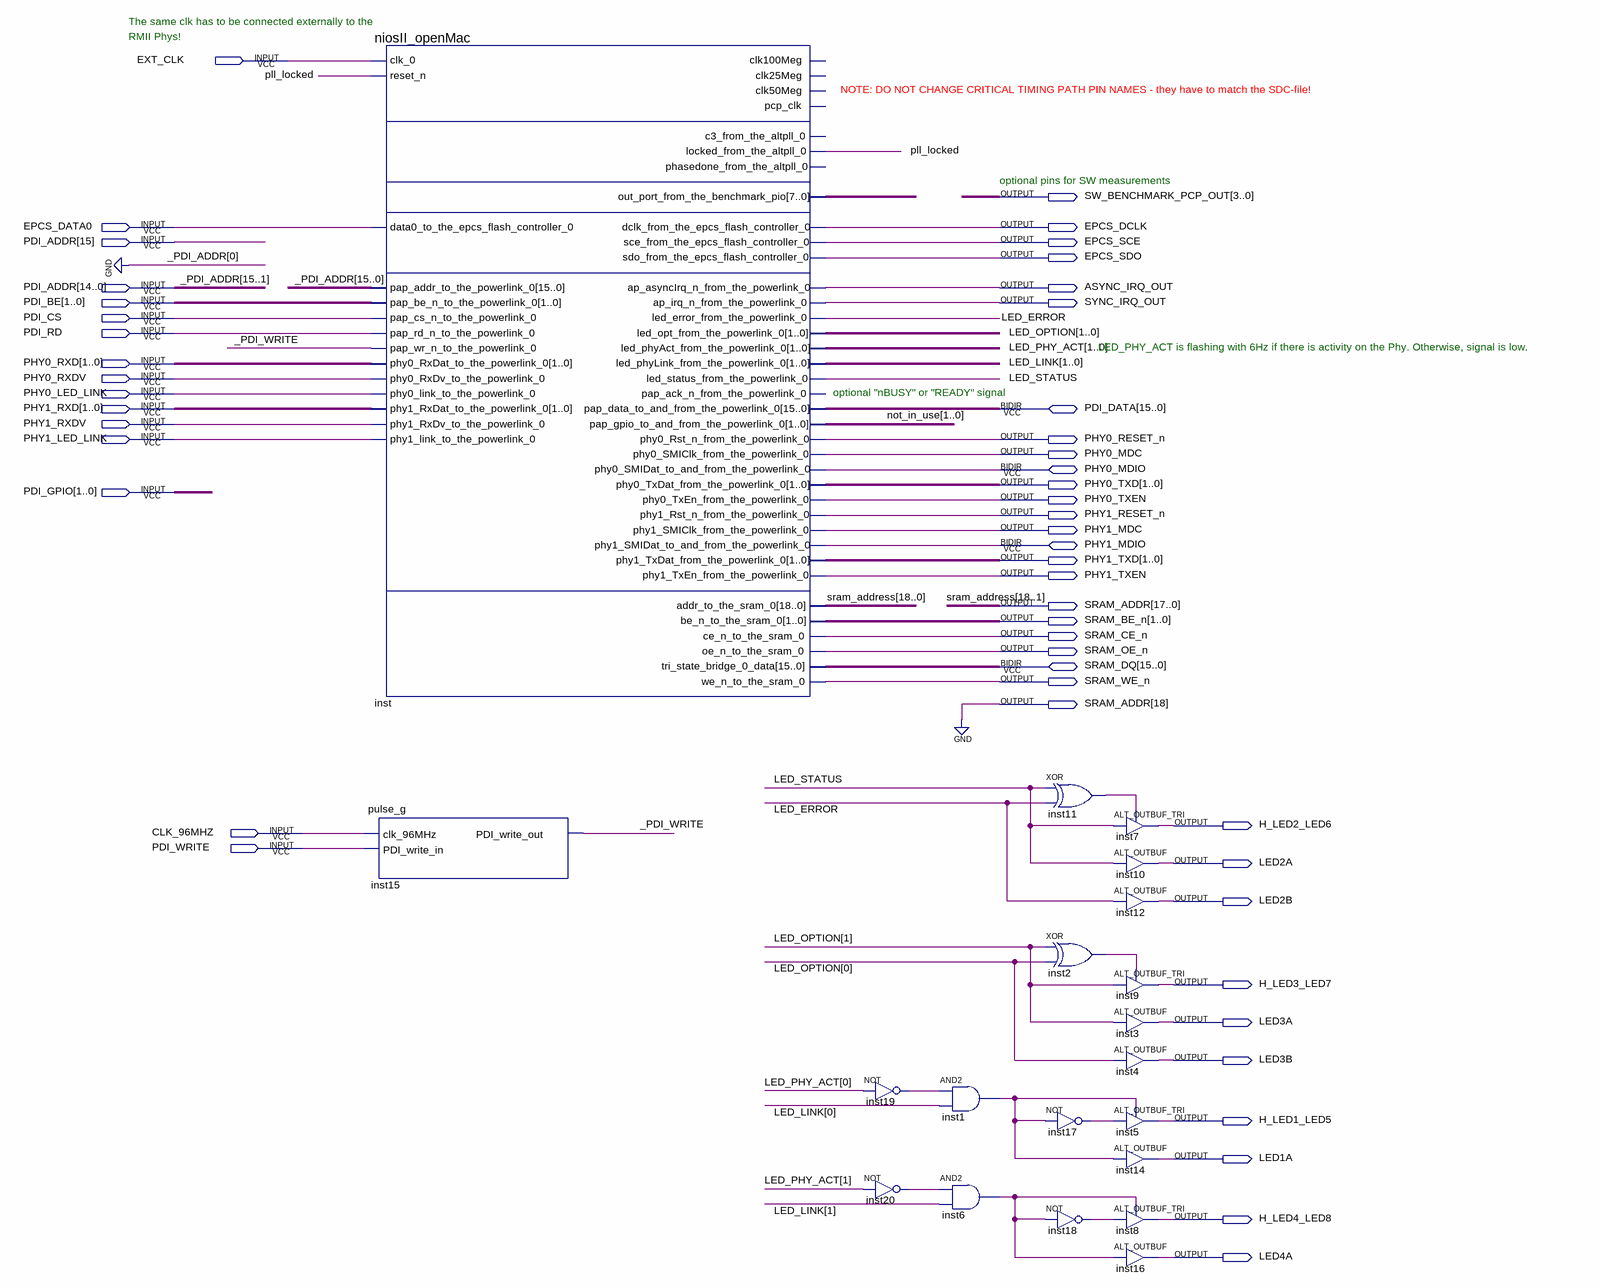
[diagram p0: schematic sheet]
// Quartus schematic nios_pll.bdf as structural Verilog: 20 symbols, 50 pins
module nios_pll (
  input  EXT_CLK,
  input  EPCS_DATA0,
  input  [15:0] PDI_ADDR,
  input  [1:0] PDI_BE,
  input  PDI_CS,
  input  PDI_RD,
  input  [1:0] PHY0_RXD,
  input  PHY0_RXDV,
  input  PHY0_LED_LINK,
  input  [1:0] PHY1_RXD,
  input  PHY1_RXDV,
  input  PHY1_LED_LINK,
  input  [1:0] PDI_GPIO,
  input  CLK_96MHZ,
  input  PDI_WRITE,
  inout  [15:0] PDI_DATA,
  inout  PHY0_MDIO,
  inout  PHY1_MDIO,
  inout  [15:0] SRAM_DQ,
  output [3:0] SW_BENCHMARK_PCP_OUT,
  output EPCS_DCLK,
  output EPCS_SCE,
  output EPCS_SDO,
  output ASYNC_IRQ_OUT,
  output SYNC_IRQ_OUT,
  output PHY0_RESET_n,
  output PHY0_MDC,
  output [1:0] PHY0_TXD,
  output PHY0_TXEN,
  output PHY1_RESET_n,
  output PHY1_MDC,
  output [1:0] PHY1_TXD,
  output PHY1_TXEN,
  output [18:0] SRAM_ADDR,
  output [1:0] SRAM_BE_n,
  output SRAM_CE_n,
  output SRAM_OE_n,
  output SRAM_WE_n,
  output H_LED2_LED6,
  output LED2A,
  output LED2B,
  output H_LED3_LED7,
  output LED3A,
  output LED3B,
  output H_LED1_LED5,
  output LED1A,
  output H_LED4_LED8,
  output LED4A
);

  wire _PDI_WRITE, inst1_out, inst2_out, inst6_out, inst11_out, inst17_out, inst18_out, inst19_out,
       inst20_out, LED_ERROR, LED_STATUS, pll_locked;
  wire [0:0] sram_address;
  wire [1:0] LED_LINK, LED_OPTION, LED_PHY_ACT, not_in_use;
  wire [7:0] inst_out_port_from_the_benchmark_pio;

  niosII_openMac inst (
    .clk_0(EXT_CLK), .reset_n(pll_locked), .data0_to_the_epcs_flash_controller_0(EPCS_DATA0),
    .pap_addr_to_the_powerlink_0({PDI_ADDR[14:0], 1'b0}), .pap_be_n_to_the_powerlink_0(PDI_BE),
    .pap_cs_n_to_the_powerlink_0(PDI_CS), .pap_rd_n_to_the_powerlink_0(PDI_RD),
    .pap_wr_n_to_the_powerlink_0(_PDI_WRITE), .phy0_RxDat_to_the_powerlink_0(PHY0_RXD),
    .phy0_RxDv_to_the_powerlink_0(PHY0_RXDV), .phy0_link_to_the_powerlink_0(PHY0_LED_LINK),
    .phy1_RxDat_to_the_powerlink_0(PHY1_RXD), .phy1_RxDv_to_the_powerlink_0(PHY1_RXDV),
    .phy1_link_to_the_powerlink_0(PHY1_LED_LINK), .locked_from_the_altpll_0(pll_locked),
    .out_port_from_the_benchmark_pio(inst_out_port_from_the_benchmark_pio),
    .dclk_from_the_epcs_flash_controller_0(EPCS_DCLK), .sce_from_the_epcs_flash_controller_0(EPCS_SCE),
    .sdo_from_the_epcs_flash_controller_0(EPCS_SDO), .ap_asyncIrq_n_from_the_powerlink_0(ASYNC_IRQ_OUT),
    .ap_irq_n_from_the_powerlink_0(SYNC_IRQ_OUT), .led_error_from_the_powerlink_0(LED_ERROR),
    .led_opt_from_the_powerlink_0(LED_OPTION), .led_phyAct_from_the_powerlink_0(LED_PHY_ACT),
    .led_phyLink_from_the_powerlink_0(LED_LINK), .led_status_from_the_powerlink_0(LED_STATUS),
    .phy0_Rst_n_from_the_powerlink_0(PHY0_RESET_n), .phy0_SMIClk_from_the_powerlink_0(PHY0_MDC),
    .phy0_TxDat_from_the_powerlink_0(PHY0_TXD), .phy0_TxEn_from_the_powerlink_0(PHY0_TXEN),
    .phy1_Rst_n_from_the_powerlink_0(PHY1_RESET_n), .phy1_SMIClk_from_the_powerlink_0(PHY1_MDC),
    .phy1_TxDat_from_the_powerlink_0(PHY1_TXD), .phy1_TxEn_from_the_powerlink_0(PHY1_TXEN),
    .addr_to_the_sram_0({SRAM_ADDR[17:0], sram_address[0]}), .be_n_to_the_sram_0(SRAM_BE_n),
    .ce_n_to_the_sram_0(SRAM_CE_n), .oe_n_to_the_sram_0(SRAM_OE_n), .we_n_to_the_sram_0(SRAM_WE_n),
    .pap_data_to_and_from_the_powerlink_0(PDI_DATA), .pap_gpio_to_and_from_the_powerlink_0(not_in_use),
    .phy0_SMIDat_to_and_from_the_powerlink_0(PHY0_MDIO), .phy1_SMIDat_to_and_from_the_powerlink_0(PHY1_MDIO),
    .tri_state_bridge_0_data(SRAM_DQ));  // open: clk100Meg, clk25Meg, clk50Meg, pcp_clk, c3_from_the_altpll_0, phasedone_from_the_altpll_0, pap_ack_n_from_the_powerlink_0
  pulse_g inst15 (.clk_96MHz(CLK_96MHZ), .PDI_write_in(PDI_WRITE), .PDI_write_out(_PDI_WRITE));
  not inst19 (inst19_out, LED_PHY_ACT[0]);
  not inst20 (inst20_out, LED_PHY_ACT[1]);
  and inst1 (inst1_out, inst19_out, LED_LINK[0]);
  and inst6 (inst6_out, inst20_out, LED_LINK[1]);
  xor inst11 (inst11_out, LED_STATUS, LED_ERROR);
  xor inst2 (inst2_out, LED_OPTION[1], LED_OPTION[0]);
  not inst17 (inst17_out, inst1_out);
  not inst18 (inst18_out, inst6_out);
  ALT_OUTBUF_TRI inst7 (.i(LED_STATUS), .oe(inst11_out), .o(H_LED2_LED6));
  ALT_OUTBUF inst10 (.i(LED_STATUS), .o(LED2A));
  ALT_OUTBUF inst12 (.i(LED_ERROR), .o(LED2B));
  ALT_OUTBUF_TRI inst9 (.i(LED_OPTION[1]), .oe(inst2_out), .o(H_LED3_LED7));
  ALT_OUTBUF inst3 (.i(LED_OPTION[1]), .o(LED3A));
  ALT_OUTBUF inst4 (.i(LED_OPTION[0]), .o(LED3B));
  ALT_OUTBUF_TRI inst5 (.i(inst17_out), .oe(inst1_out), .o(H_LED1_LED5));
  ALT_OUTBUF inst14 (.i(inst1_out), .o(LED1A));
  ALT_OUTBUF_TRI inst8 (.i(inst18_out), .oe(inst6_out), .o(H_LED4_LED8));
  ALT_OUTBUF inst16 (.i(inst6_out), .o(LED4A));

  assign SRAM_ADDR[18] = 1'b0;

  // Other names for the same wires on the sheet: _PDI_ADDR[15:1] = PDI_ADDR[14:0];
  //   sram_address[18:1] = SRAM_ADDR[17:0]

  // Notes on the sheet:
  //   The same clk has to be connected externally to the
  //   RMII Phys!
  //   NOTE: DO NOT CHANGE CRITICAL TIMING PATH PIN NAMES - they have to match the SDC-file!
  //   optional pins for SW measurements
  //   LED_PHY_ACT is flashing with 6Hz if there is activity on the Phy. Otherwise, signal is low.
  //   optional "nBUSY" or "READY" signal
endmodule
